# Altium project S6_FLHS_A2D-pcb-AW1.PrjPcb (part 1 of 3)
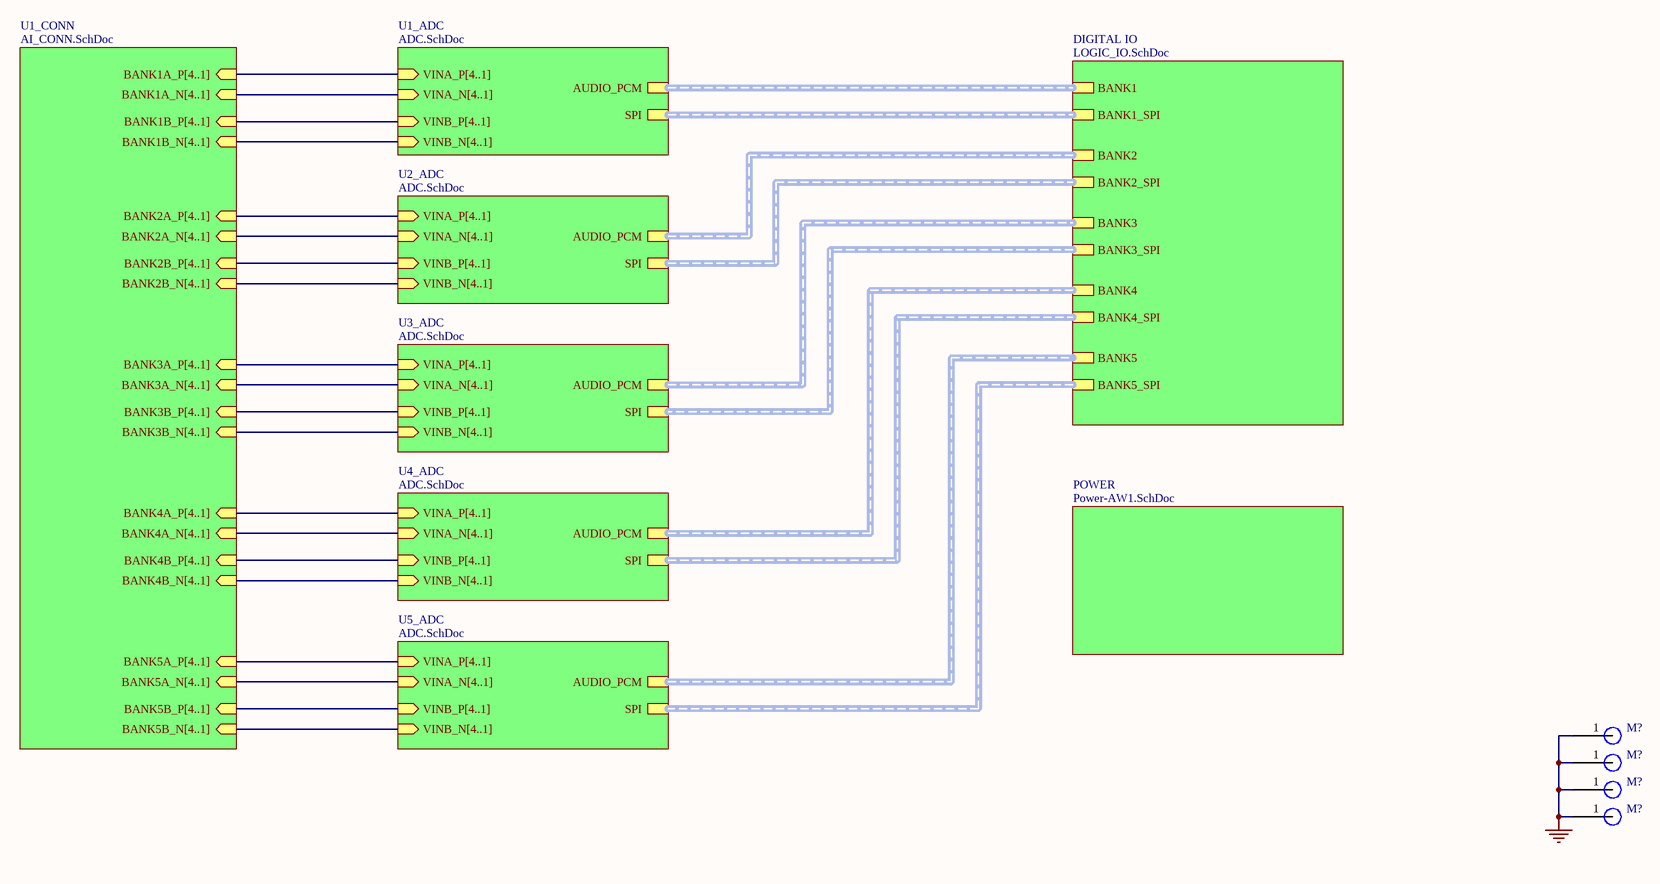
[diagram p0: Landing-AW1.SchDoc]
5 sheets, 1395 parts. Net scope: hierarchical (ports join the sheet entries above them; power ports are global).
Board file: S6_FLHS_A2D-pcb-AW1.PcbDoc
Sheets:
  Landing-AW1.SchDoc
    U1_ADC = ADC.SchDoc
      U_ADC_DRIVER1 = ADC_DRIVER.SchDoc
      U_ADC_DRIVER2 = ADC_DRIVER.SchDoc
      U_ADC_DRIVER3 = ADC_DRIVER.SchDoc
      U_ADC_DRIVER4 = ADC_DRIVER.SchDoc
      U_ADC_DRIVER5 = ADC_DRIVER.SchDoc
      U_ADC_DRIVER6 = ADC_DRIVER.SchDoc
      U_ADC_DRIVER7 = ADC_DRIVER.SchDoc
      U_ADC_DRIVER8 = ADC_DRIVER.SchDoc
    POWER = Power-AW1.SchDoc
    U2_ADC = ADC.SchDoc
      U_ADC_DRIVER1 = ADC_DRIVER.SchDoc
      U_ADC_DRIVER2 = ADC_DRIVER.SchDoc
      U_ADC_DRIVER3 = ADC_DRIVER.SchDoc
      U_ADC_DRIVER4 = ADC_DRIVER.SchDoc
      U_ADC_DRIVER5 = ADC_DRIVER.SchDoc
      U_ADC_DRIVER6 = ADC_DRIVER.SchDoc
      U_ADC_DRIVER7 = ADC_DRIVER.SchDoc
      U_ADC_DRIVER8 = ADC_DRIVER.SchDoc
    U3_ADC = ADC.SchDoc
      U_ADC_DRIVER1 = ADC_DRIVER.SchDoc
      U_ADC_DRIVER2 = ADC_DRIVER.SchDoc
      U_ADC_DRIVER3 = ADC_DRIVER.SchDoc
      U_ADC_DRIVER4 = ADC_DRIVER.SchDoc
      U_ADC_DRIVER5 = ADC_DRIVER.SchDoc
      U_ADC_DRIVER6 = ADC_DRIVER.SchDoc
      U_ADC_DRIVER7 = ADC_DRIVER.SchDoc
      U_ADC_DRIVER8 = ADC_DRIVER.SchDoc
    U4_ADC = ADC.SchDoc
      U_ADC_DRIVER1 = ADC_DRIVER.SchDoc
      U_ADC_DRIVER2 = ADC_DRIVER.SchDoc
      U_ADC_DRIVER3 = ADC_DRIVER.SchDoc
      U_ADC_DRIVER4 = ADC_DRIVER.SchDoc
      U_ADC_DRIVER5 = ADC_DRIVER.SchDoc
      U_ADC_DRIVER6 = ADC_DRIVER.SchDoc
      U_ADC_DRIVER7 = ADC_DRIVER.SchDoc
      U_ADC_DRIVER8 = ADC_DRIVER.SchDoc
    U5_ADC = ADC.SchDoc
      U_ADC_DRIVER1 = ADC_DRIVER.SchDoc
      U_ADC_DRIVER2 = ADC_DRIVER.SchDoc
      U_ADC_DRIVER3 = ADC_DRIVER.SchDoc
      U_ADC_DRIVER4 = ADC_DRIVER.SchDoc
      U_ADC_DRIVER5 = ADC_DRIVER.SchDoc
      U_ADC_DRIVER6 = ADC_DRIVER.SchDoc
      U_ADC_DRIVER7 = ADC_DRIVER.SchDoc
      U_ADC_DRIVER8 = ADC_DRIVER.SchDoc
    U1_CONN = AI_CONN.SchDoc

## Sheet Landing-AW1.SchDoc
size B; SheetNumber: 1; SheetTotal: 5

### Parts
(Parts that share a designator on the sheet are numbered #1, #2 ... from top to bottom, then left to right.)
M?#1  MNT_HOLE  [TP-PTH-65/100]  (value not drawn)
M?#2  MNT_HOLE  [TP-PTH-65/100]  (value not drawn)
M?#3  MNT_HOLE  [TP-PTH-65/100]  (value not drawn)
M?#4  MNT_HOLE  [TP-PTH-65/100]  (value not drawn)

### Sub-sheets
DIGITAL IO = LOGIC_IO.SchDoc (file not in this document): BANK1 (harness PCM_AUDIO_H), BANK2 (harness PCM_AUDIO_H), BANK3 (harness PCM_AUDIO_H), BANK1_SPI (harness PCM_SPI_CONFIG_H), BANK2_SPI (harness PCM_SPI_CONFIG_H), BANK3_SPI (harness PCM_SPI_CONFIG_H), BANK4 (harness PCM_AUDIO_H), BANK5 (harness PCM_AUDIO_H), BANK4_SPI (harness PCM_SPI_CONFIG_H), BANK5_SPI (harness PCM_SPI_CONFIG_H)
POWER = Power-AW1.SchDoc: no entries
U1_ADC = ADC.SchDoc: AUDIO_PCM (harness PCM_AUDIO_H), SPI (harness PCM_SPI_CONFIG_H), VINA_P[4..1] (in), VINA_N[4..1] (in), VINB_N[4..1] (in), VINB_P[4..1] (in)
U1_CONN = AI_CONN.SchDoc: BANK1A_P[4..1] (in), BANK1A_N[4..1] (in), BANK2A_P[4..1] (in), BANK2A_N[4..1] (in), BANK1B_P[4..1] (in), BANK1B_N[4..1] (in), BANK2B_P[4..1] (in), BANK2B_N[4..1] (in), BANK3A_P[4..1] (in), BANK3A_N[4..1] (in), BANK3B_P[4..1] (in), BANK3B_N[4..1] (in), BANK4A_P[4..1] (in), BANK4A_N[4..1] (in), BANK4B_P[4..1] (in), BANK4B_N[4..1] (in), BANK5A_P[4..1] (in), BANK5A_N[4..1] (in), BANK5B_P[4..1] (in), BANK5B_N[4..1] (in)
U2_ADC = ADC.SchDoc: AUDIO_PCM (harness PCM_AUDIO_H), SPI (harness PCM_SPI_CONFIG_H), VINA_P[4..1] (in), VINA_N[4..1] (in), VINB_N[4..1] (in), VINB_P[4..1] (in)
U3_ADC = ADC.SchDoc: AUDIO_PCM (harness PCM_AUDIO_H), SPI (harness PCM_SPI_CONFIG_H), VINA_P[4..1] (in), VINA_N[4..1] (in), VINB_N[4..1] (in), VINB_P[4..1] (in)
U4_ADC = ADC.SchDoc: AUDIO_PCM (harness PCM_AUDIO_H), SPI (harness PCM_SPI_CONFIG_H), VINA_P[4..1] (in), VINA_N[4..1] (in), VINB_N[4..1] (in), VINB_P[4..1] (in)
U5_ADC = ADC.SchDoc: AUDIO_PCM (harness PCM_AUDIO_H), SPI (harness PCM_SPI_CONFIG_H), VINA_P[4..1] (in), VINA_N[4..1] (in), VINB_N[4..1] (in), VINB_P[4..1] (in)

### Nets
GND: M?#1.1 M?#2.1 M?#3.1 M?#4.1

### Buses and harness runs
bus sheet U1_ADC/VINA_N[4..1] = sheet U1_CONN/BANK1A_N[4..1]
bus sheet U1_ADC/VINA_P[4..1] = sheet U1_CONN/BANK1A_P[4..1]
bus sheet U1_ADC/VINB_N[4..1] = sheet U1_CONN/BANK1B_N[4..1]
bus sheet U1_ADC/VINB_P[4..1] = sheet U1_CONN/BANK1B_P[4..1]
bus sheet U1_CONN/BANK2A_N[4..1] = sheet U2_ADC/VINA_N[4..1]
bus sheet U1_CONN/BANK2A_P[4..1] = sheet U2_ADC/VINA_P[4..1]
bus sheet U1_CONN/BANK2B_N[4..1] = sheet U2_ADC/VINB_N[4..1]
bus sheet U1_CONN/BANK2B_P[4..1] = sheet U2_ADC/VINB_P[4..1]
bus sheet U1_CONN/BANK3A_N[4..1] = sheet U3_ADC/VINA_N[4..1]
bus sheet U1_CONN/BANK3A_P[4..1] = sheet U3_ADC/VINA_P[4..1]
bus sheet U1_CONN/BANK3B_N[4..1] = sheet U3_ADC/VINB_N[4..1]
bus sheet U1_CONN/BANK3B_P[4..1] = sheet U3_ADC/VINB_P[4..1]
bus sheet U1_CONN/BANK4A_N[4..1] = sheet U4_ADC/VINA_N[4..1]
bus sheet U1_CONN/BANK4A_P[4..1] = sheet U4_ADC/VINA_P[4..1]
bus sheet U1_CONN/BANK4B_N[4..1] = sheet U4_ADC/VINB_N[4..1]
bus sheet U1_CONN/BANK4B_P[4..1] = sheet U4_ADC/VINB_P[4..1]
bus sheet U1_CONN/BANK5A_N[4..1] = sheet U5_ADC/VINA_N[4..1]
bus sheet U1_CONN/BANK5A_P[4..1] = sheet U5_ADC/VINA_P[4..1]
bus sheet U1_CONN/BANK5B_N[4..1] = sheet U5_ADC/VINB_N[4..1]
bus sheet U1_CONN/BANK5B_P[4..1] = sheet U5_ADC/VINB_P[4..1]
harness sheet DIGITAL IO/BANK1 = sheet U1_ADC/AUDIO_PCM
harness sheet DIGITAL IO/BANK1_SPI = sheet U1_ADC/SPI
harness sheet DIGITAL IO/BANK2 = sheet U2_ADC/AUDIO_PCM
harness sheet DIGITAL IO/BANK2_SPI = sheet U2_ADC/SPI
harness sheet DIGITAL IO/BANK3 = sheet U3_ADC/AUDIO_PCM
harness sheet DIGITAL IO/BANK3_SPI = sheet U3_ADC/SPI
harness sheet DIGITAL IO/BANK4 = sheet U4_ADC/AUDIO_PCM
harness sheet DIGITAL IO/BANK4_SPI = sheet U4_ADC/SPI
harness sheet DIGITAL IO/BANK5 = sheet U5_ADC/AUDIO_PCM
harness sheet DIGITAL IO/BANK5_SPI = sheet U5_ADC/SPI

## Sheet ADC.SchDoc
size C; SheetNumber: 3; SheetTotal: 5
Used 5 times, as channels U1_ADC, U2_ADC, U3_ADC, U4_ADC, U5_ADC. Parts and nets are listed once, with the designators drawn on the sheet.
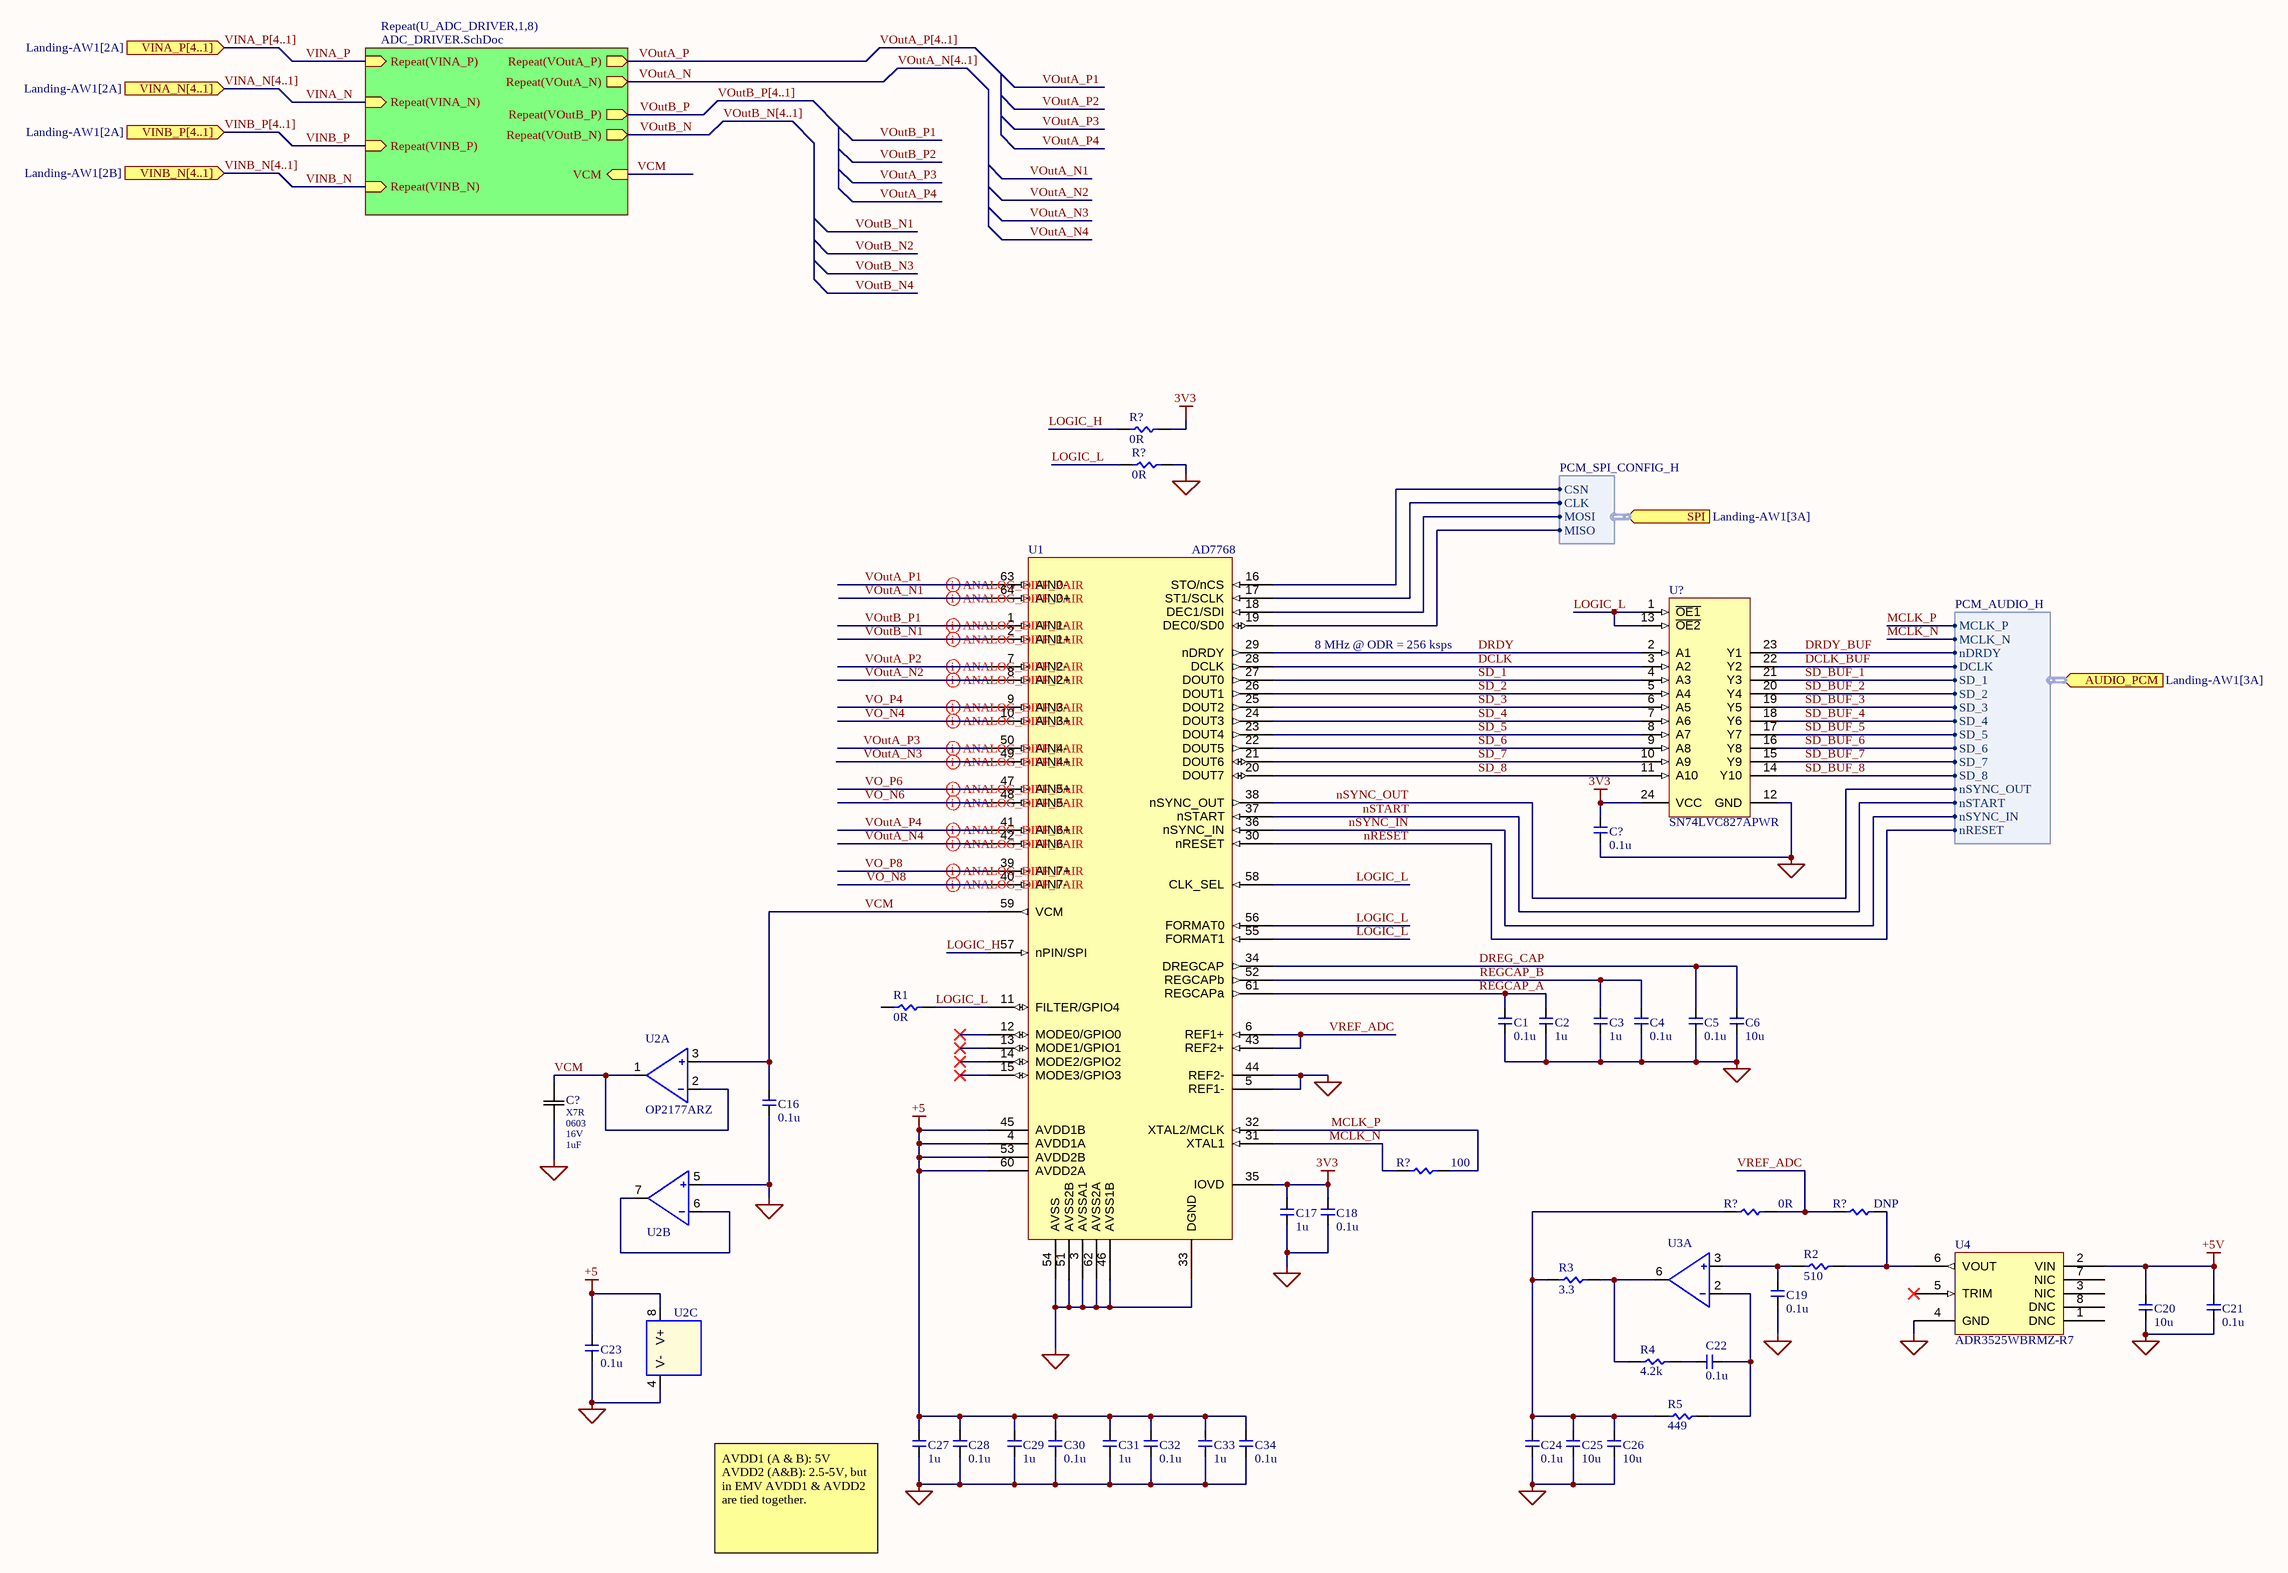
[diagram p1: ADC.SchDoc]

### Parts
(Parts that share a designator on the sheet are numbered #1, #2 ... from top to bottom, then left to right.)
C1  0.1u  [RES_0402]
C2  1u  [CAP_0603]
C3  1u  [CAP_0603]
C4  0.1u  [RES_0402]
C5  0.1u  [RES_0402]
C6  10u  [CAP_0805]
C16  0.1u  [RES_0402]
C17  1u  [CAP_0603]
C18  0.1u  [RES_0402]
C19  0.1u  [RES_0402]
C20  10u  [CAP_0805]
C21  0.1u  [RES_0402]
C22  0.1u  [RES_0402]
C23  0.1u  [RES_0402]
C24  0.1u  [RES_0402]
C25  10u  [CAP_0805]
C26  10u  [CAP_0805]
C27  1u  [CAP_0603]
C28  0.1u  [RES_0402]
C29  1u  [CAP_0603]
C30  0.1u  [RES_0402]
C31  1u  [CAP_0603]
C32  0.1u  [RES_0402]
C33  1u  [CAP_0603]
C34  0.1u  [RES_0402]
C?#1  0.1u  [RES_0402]
C?#2  Temperature Coefficient: X7R  Package: 0603  Voltage - Rated: 16V  Capacitance: 1uF  [CAP_CC0603_YAG]  (hidden comment: CC0603JRX7R7BB105)
R1  0R  [RES_0402]
R2  510  [RES_0402]
R3  3.3  [RES_0402]
R4  4.2k  [RES_0402]
R5  449  [RES_0402]
R?#1  0R  [RES_0402]
R?#2  0R  [RES_0402]
R?#3  100  [RES_0402]
R?#4  0R  [RES_0402]
R?#5  DNP  [RES_0402]
U1  AD7768
U2  OP2177ARZ  [OPA2217_SOIC127P600X175-8N]  (parts A,B,C of 3)
U3  ADA4841-1YRZ-R7  [OPA2217_SOIC127P600X175-8N]  (value not drawn)  (part A of 2)
U4  ADR3525WBRMZ-R7  [ADR44x_SOP127P600-8N]
U?  SN74LVC827APWR  [PW0024A_N]

### Sub-sheets
Repeat(U_ADC_DRIVER,1,8) = ADC_DRIVER.SchDoc: Repeat(VINA_P) (in), Repeat(VOutA_P) (out), Repeat(VOutA_N) (out), Repeat(VINA_N) (in), Repeat(VINB_P) (in), Repeat(VINB_N) (in), Repeat(VOutB_P) (out), Repeat(VOutB_N) (out), VCM (in)

### Ports
AUDIO_PCM (in, harness PCM_AUDIO_H, see Landing-AW1[3A]), SPI (in, harness PCM_SPI_CONFIG_H, see Landing-AW1[3A]), VINA_N[4..1] (in, see Landing-AW1[2A]), VINA_P[4..1] (in, see Landing-AW1[2A]), VINB_N[4..1] (in, see Landing-AW1[2B]), VINB_P[4..1] (in, see Landing-AW1[2A])

### Harnesses
PCM_SPI_CONFIG_H: CLK, CSN, MISO, MOSI
PCM_AUDIO_H: MCLK_P, nDRDY, DCLK, SD_1, SD_2, SD_3, SD_4, nRESET, SD_5, SD_6, SD_7, SD_8, nSYNC_IN, nSYNC_OUT, nSTART, MCLK_N

### Nets
3V3: C17.2 C18.2 C?#1.2 R?#1.1 U1.35(IOVD) U?.24(VCC)
+5: C23.2 C27.2 C28.2 C29.2 C30.2 C31.2 C32.2 C33.2 C34.2 U1.4(AVDD1A) U1.45(AVDD1B) U1.53(AVDD2B) U1.60(AVDD2A) U2.8(V+)
+5V: C20.2 C21.2 U4.2(VIN)
GND: C1.1 C2.1 C3.1 C4.1 C5.1 C6.1 C16.1 C17.1 C18.1 C19.1 C20.1 C21.1 C23.1 C24.2 C25.1 C26.1 C27.1 C28.1 C29.1 C30.1 C31.1 C32.1 C33.1 C34.1 C?#1.1 C?#2.1 R?#2.1 U1.3(AVSSA1) U1.5(REF1-) U1.33(DGND) U1.44(REF2-) U1.46(AVSS1B) U1.51(AVSS2B) U1.54(AVSS) U1.62(AVSS2A) U2.4(V-) U2.5 U4.4(GND) U?.12(GND)
DCLK: U1.28(DCLK) U?.3(A2)
DCLK_BUF: U?.22(Y2) ; port AUDIO_PCM.DCLK
DRDY: U1.29(nDRDY) U?.2(A1)
DRDY_BUF: U?.23(Y1) ; port AUDIO_PCM.nDRDY
DREG_CAP: C5.2 C6.2 U1.34(DREGCAP)
LOGIC_H: R?#1.0 U1.57(nPIN/SPI)
LOGIC_L: R1.1 R?#2.0 U1.11(FILTER/GPIO4) U1.55(FORMAT1) U1.56(FORMAT0) U1.58(CLK_SEL) U?.1(~{OE1}) U?.13(~{OE2})
MCLK_N: R?#3.1 U1.31(XTAL1) ; port AUDIO_PCM.MCLK_N
MCLK_P: R?#3.0 U1.32(XTAL2/MCLK) ; port AUDIO_PCM.MCLK_P
nRESET: U1.30(nRESET) ; port AUDIO_PCM.nRESET
nSTART: U1.37(nSTART) ; port AUDIO_PCM.nSTART
nSYNC_IN: U1.36(nSYNC_IN) ; port AUDIO_PCM.nSYNC_IN
nSYNC_OUT: U1.38(nSYNC_OUT) ; port AUDIO_PCM.nSYNC_OUT
REGCAP_A: C1.2 C2.2 U1.61(REGCAPa)
REGCAP_B: C3.2 C4.2 U1.52(REGCAPb)
SD_1: U1.27(DOUT0) U?.4(A3)
SD_2: U1.26(DOUT1) U?.5(A4)
SD_3: U1.25(DOUT2) U?.6(A5)
SD_4: U1.24(DOUT3) U?.7(A6)
SD_5: U1.23(DOUT4) U?.8(A7)
SD_6: U1.22(DOUT5) U?.9(A8)
SD_7: U1.21(DOUT6) U?.10(A9)
SD_8: U1.20(DOUT7) U?.11(A10)
SD_BUF_1: U?.21(Y3) ; port AUDIO_PCM.SD_1
SD_BUF_2: U?.20(Y4) ; port AUDIO_PCM.SD_2
SD_BUF_3: U?.19(Y5) ; port AUDIO_PCM.SD_3
SD_BUF_4: U?.18(Y6) ; port AUDIO_PCM.SD_4
SD_BUF_5: U?.17(Y7) ; port AUDIO_PCM.SD_5
SD_BUF_6: U?.16(Y8) ; port AUDIO_PCM.SD_6
SD_BUF_7: U?.15(Y9) ; port AUDIO_PCM.SD_7
SD_BUF_8: U?.14(Y10) ; port AUDIO_PCM.SD_8
VCM: C16.2 C?#2.2 U1.59(VCM) U2.1 U2.2 U2.3 ; sheet Repeat(U_ADC_DRIVER,1,8)/VCM
VINA_N: sheet Repeat(U_ADC_DRIVER,1,8)/Repeat(VINA_N)
VINA_P: sheet Repeat(U_ADC_DRIVER,1,8)/Repeat(VINA_P)
VINB_N: sheet Repeat(U_ADC_DRIVER,1,8)/Repeat(VINB_N)
VINB_P: sheet Repeat(U_ADC_DRIVER,1,8)/Repeat(VINB_P)
VO_N4: U1.10(AIN3+)
VO_N6: U1.48(AIN5-)
VO_N8: U1.40(AIN7-)
VO_P4: U1.9(AIN3-)
VO_P6: U1.47(AIN5+)
VO_P8: U1.39(AIN7+)
VOutA_N: sheet Repeat(U_ADC_DRIVER,1,8)/Repeat(VOutA_N)
VOutA_N1: U1.64(AIN0+)
VOutA_N2: U1.8(AIN2+)
VOutA_N3: U1.49(AIN4+)
VOutA_N4: U1.42(AIN6-)
VOutA_P: sheet Repeat(U_ADC_DRIVER,1,8)/Repeat(VOutA_P)
VOutA_P1: U1.63(AIN0-)
VOutA_P2: U1.7(AIN2-)
VOutA_P3: U1.50(AIN4-)
VOutA_P4: U1.41(AIN6+)
VOutB_N: sheet Repeat(U_ADC_DRIVER,1,8)/Repeat(VOutB_N)
VOutB_N1: U1.2(AIN1+)
VOutB_P: sheet Repeat(U_ADC_DRIVER,1,8)/Repeat(VOutB_P)
VOutB_P1: U1.1(AIN1-)
VREF_ADC: R?#4.0 R?#5.1 U1.6(REF1+) U1.43(REF2+)
NetC19_2: C19.2 R2.0 U3.3
NetC22_1: C22.1 R5.1 U3.2
NetC22_2: C22.2 R4.1
NetC24_1: C24.1 C25.2 C26.2 R3.0 R5.0 R?#4.1
NetR2_1: R2.1 R?#5.0 U4.6(VOUT)
NetR3_1: R3.1 R4.0 U3.6
NetU1_16: U1.16(STO/nCS) ; port SPI.CSN
NetU1_17: U1.17(ST1/SCLK) ; port SPI.CLK
NetU1_18: U1.18(DEC1/SDI) ; port SPI.MOSI
NetU1_19: U1.19(DEC0/SD0) ; port SPI.MISO
NetU2_6: U2.6 U2.7

Not connected (* = marked no-connect by the designer): R1 0; U1 12(MODE0/GPIO0)* 13(MODE1/GPIO1)* 14(MODE2/GPIO2)* 15(MODE3/GPIO3)*; U4 1(DNC) 3(NIC) 5(TRIM)* 7(NIC) 8(DNC)

### Channels
U1_ADC: designators C1=C1_U1_ADC C2=C2_U1_ADC C3=C3_U1_ADC C4=C4_U1_ADC C5=C5_U1_ADC C6=C6_U1_ADC C16=C16_U1_ADC C17=C17_U1_ADC C18=C18_U1_ADC C19=C19_U1_ADC C20=C20_U1_ADC C21=C21_U1_ADC C22=C22_U1_ADC C23=C23_U1_ADC C24=C24_U1_ADC C25=C25_U1_ADC C26=C26_U1_ADC C27=C27_U1_ADC C28=C28_U1_ADC C29=C29_U1_ADC C30=C30_U1_ADC C31=C31_U1_ADC C32=C32_U1_ADC C33=C33_U1_ADC C34=C34_U1_ADC C?=C?_U1_ADC#1 C?=C?_U1_ADC#2 R1=R1_U1_ADC R2=R2_U1_ADC R3=R3_U1_ADC R4=R4_U1_ADC R5=R5_U1_ADC R?=R?_U1_ADC#5 R?=R?_U1_ADC#4 R?=R?_U1_ADC#3 R?=R?_U1_ADC#2 R?=R?_U1_ADC#1 U1=U1_U1_ADC U2=U2_U1_ADC U3=U3_U1_ADC U4=U4_U1_ADC U?=U?_U1_ADC
U2_ADC: designators C1=C1_U2_ADC C2=C2_U2_ADC C3=C3_U2_ADC C4=C4_U2_ADC C5=C5_U2_ADC C6=C6_U2_ADC C16=C16_U2_ADC C17=C17_U2_ADC C18=C18_U2_ADC C19=C19_U2_ADC C20=C20_U2_ADC C21=C21_U2_ADC C22=C22_U2_ADC C23=C23_U2_ADC C24=C24_U2_ADC C25=C25_U2_ADC C26=C26_U2_ADC C27=C27_U2_ADC C28=C28_U2_ADC C29=C29_U2_ADC C30=C30_U2_ADC C31=C31_U2_ADC C32=C32_U2_ADC C33=C33_U2_ADC C34=C34_U2_ADC C?=C?_U2_ADC#1 C?=C?_U2_ADC#2 R1=R1_U2_ADC R2=R2_U2_ADC R3=R3_U2_ADC R4=R4_U2_ADC R5=R5_U2_ADC R?=R?_U2_ADC#5 R?=R?_U2_ADC#4 R?=R?_U2_ADC#3 R?=R?_U2_ADC#2 R?=R?_U2_ADC#1 U1=U1_U2_ADC U2=U2_U2_ADC U3=U3_U2_ADC U4=U4_U2_ADC U?=U?_U2_ADC
U3_ADC: designators C1=C1_U3_ADC C2=C2_U3_ADC C3=C3_U3_ADC C4=C4_U3_ADC C5=C5_U3_ADC C6=C6_U3_ADC C16=C16_U3_ADC C17=C17_U3_ADC C18=C18_U3_ADC C19=C19_U3_ADC C20=C20_U3_ADC C21=C21_U3_ADC C22=C22_U3_ADC C23=C23_U3_ADC C24=C24_U3_ADC C25=C25_U3_ADC C26=C26_U3_ADC C27=C27_U3_ADC C28=C28_U3_ADC C29=C29_U3_ADC C30=C30_U3_ADC C31=C31_U3_ADC C32=C32_U3_ADC C33=C33_U3_ADC C34=C34_U3_ADC C?=C?_U3_ADC#1 C?=C?_U3_ADC#2 R1=R1_U3_ADC R2=R2_U3_ADC R3=R3_U3_ADC R4=R4_U3_ADC R5=R5_U3_ADC R?=R?_U3_ADC#5 R?=R?_U3_ADC#4 R?=R?_U3_ADC#3 R?=R?_U3_ADC#2 R?=R?_U3_ADC#1 U1=U1_U3_ADC U2=U2_U3_ADC U3=U3_U3_ADC U4=U4_U3_ADC U?=U?_U3_ADC
U4_ADC: designators C1=C1_U4_ADC C2=C2_U4_ADC C3=C3_U4_ADC C4=C4_U4_ADC C5=C5_U4_ADC C6=C6_U4_ADC C16=C16_U4_ADC C17=C17_U4_ADC C18=C18_U4_ADC C19=C19_U4_ADC C20=C20_U4_ADC C21=C21_U4_ADC C22=C22_U4_ADC C23=C23_U4_ADC C24=C24_U4_ADC C25=C25_U4_ADC C26=C26_U4_ADC C27=C27_U4_ADC C28=C28_U4_ADC C29=C29_U4_ADC C30=C30_U4_ADC C31=C31_U4_ADC C32=C32_U4_ADC C33=C33_U4_ADC C34=C34_U4_ADC C?=C?_U4_ADC#1 C?=C?_U4_ADC#2 R1=R1_U4_ADC R2=R2_U4_ADC R3=R3_U4_ADC R4=R4_U4_ADC R5=R5_U4_ADC R?=R?_U4_ADC#5 R?=R?_U4_ADC#4 R?=R?_U4_ADC#3 R?=R?_U4_ADC#2 R?=R?_U4_ADC#1 U1=U1_U4_ADC U2=U2_U4_ADC U3=U3_U4_ADC U4=U4_U4_ADC U?=U?_U4_ADC
U5_ADC: designators C1=C1_U5_ADC C2=C2_U5_ADC C3=C3_U5_ADC C4=C4_U5_ADC C5=C5_U5_ADC C6=C6_U5_ADC C16=C16_U5_ADC C17=C17_U5_ADC C18=C18_U5_ADC C19=C19_U5_ADC C20=C20_U5_ADC C21=C21_U5_ADC C22=C22_U5_ADC C23=C23_U5_ADC C24=C24_U5_ADC C25=C25_U5_ADC C26=C26_U5_ADC C27=C27_U5_ADC C28=C28_U5_ADC C29=C29_U5_ADC C30=C30_U5_ADC C31=C31_U5_ADC C32=C32_U5_ADC C33=C33_U5_ADC C34=C34_U5_ADC C?=C?_U5_ADC#1 C?=C?_U5_ADC#2 R1=R1_U5_ADC R2=R2_U5_ADC R3=R3_U5_ADC R4=R4_U5_ADC R5=R5_U5_ADC R?=R?_U5_ADC#5 R?=R?_U5_ADC#4 R?=R?_U5_ADC#3 R?=R?_U5_ADC#2 R?=R?_U5_ADC#1 U1=U1_U5_ADC U2=U2_U5_ADC U3=U3_U5_ADC U4=U4_U5_ADC U?=U?_U5_ADC

### Buses and harness runs
bus VINA_N[4..1] = port VINA_N[4..1]
bus VINA_P[4..1] = port VINA_P[4..1]
bus VINB_N[4..1] = port VINB_N[4..1]
bus VINB_P[4..1] = port VINB_P[4..1]
bus VOutA_N[4..1]
bus VOutA_P[4..1]
bus VOutB_N[4..1]
bus VOutB_P[4..1]

### Layout directives
differential pair: VO_N4_U1_ADC, VO_N6_U1_ADC, VO_N8_U1_ADC, VO_P4_U1_ADC, VO_P6_U1_ADC, VO_P8_U1_ADC, VOutA_N1_U1_ADC, VOutA_N2_U1_ADC, VOutA_N3_U1_ADC, VOutA_N4_U1_ADC, VOutA_P1_U1_ADC, VOutA_P2_U1_ADC, VOutA_P3_U1_ADC, VOutA_P4_U1_ADC, VOutB_N1_U1_ADC, VOutB_P1_U1_ADC

### Notes on the sheet
- 8 MHz @ ODR = 256 ksps
- (near C27) AVDD1 (A & B): 5V
  AVDD2 (A&B): 2.5-5V, but in EMV AVDD1 & AVDD2 are tied together.
- DWG. NO.
- REV.
- SHT.
- THIS DOCUMENT AND THE DATA DISCLOSED HEREIN OR HEREWITH IS THE PROPERTY OF ALTIUM LIMITED AND MAY BE FREELY DISTRIBUTED IN WHOLE. NO RIGHTS ARE RESERVED OR EXPRESS OR IMPLIED WARANTEE GIVEN.
- REVISION
- DESCRIPTION
- DATE
- APPROVED
- ENG:
- APPROVALS
- PROJECT
- DSN:
- CHK:
- REFERENCE DOCUMENTS
- PROJECT REVISION:
- TITLE
- DOCUMENT REVISION:
- DESIGN ITEM:
- BOM:
- FAB DWG:
- PCB DWG:
- ASSY DWG:
- SCALE:
- SIZE
- B
- CAGE CODE
- FILE NAME
- DWG NO.
- SHEET
- OF
- REV

### Library data of the parts
C1 C4 C5 C16 C18 C19 C21-C24 C28 C30 C32 C34 C?#1 = CAP_0402: CAP SMD 0402; Tolerance: *; Voltage Rating: *; Manufacturer: *; Part Number: *
C2 C3 = CAP_0603: 1u 0603 X7R; Tolerance: *; Voltage Rating: *; Manufacturer: *; Part Number: *
C6 C20 C25 C26 = CAP_0805: CAP SMD 0805; Tolerance: *; Voltage Rating: *; Manufacturer: *; Part Number: *
C17 C27 C29 C31 C33 = CAP_0603: CAP SMD 0603; Tolerance: *; Voltage Rating: *; Manufacturer: *; Part Number: *
C?#2 = CC0603JRX7R7BB105: 1 µF ±5% 16V Ceramic Capacitor X7R 0603 (1608 Metric); Manufacturer: Yageo; Vendor PN: 311-3485-2-ND; Vendor: Digikey; Copyright: Copyright (C) 2025 Ultra Librarian. All rights reserved.; Manufacturer PN: CC0603JRX7R7BB105; Tolerance: 5%
R1-R5 R?#1-R?#5 = RES_0402: RES SMD 0402; Manufacturer: *; Part Number: *; Power Rating: *
U1 = AD7768: ADC, 256 ksps, 8 ch, simultaneous 24b
U2 = OP2177ARZ: OPAMP GEN PURPOSE, 1.3MHz, Low Offset
U3 = ADA4841-1YRZ-R7: OPAMP 80 MHz, VREF DRIVER
U4 = ADR44x: Analog Devices, Reference voltage, MSOP8, 2.5V voltage reference
U? = CMP-0440-00213-3: 10-Bit Buffer/Driver With 3-State Outputs, PW0024A, LARGE T&R; Manufacturer: Texas Instruments; tpd @ Nom Voltage(Max)(ns): 7.1,6.7; Voltage(Nom)(V): 1.8,2.5,2.7,3.3; Bits(#): 10; Output Type: LVTTL; ICC @ Nom Voltage(Max)(mA): 0.01; Input Type: TTL/CMOS; F @ Nom Voltage(Max)(Mhz): 100; VCC(Max)(V): 3.6; VCC(Min)(V): 1.65; Rating: Catalog; PackageVersion: http://www.ti.com/lit/ml/mpds363/mpds363.pdf; Generic Part Number: SN74LVC827A; Code_JEDEC: MO-153; PackageReference: PW0024A; Operating Temperature Range(C): -40 to 85; DatasheetVersion: SCAS306K